# EAGLE design Board Tanggal v2 (EAGLE 6.6.0)
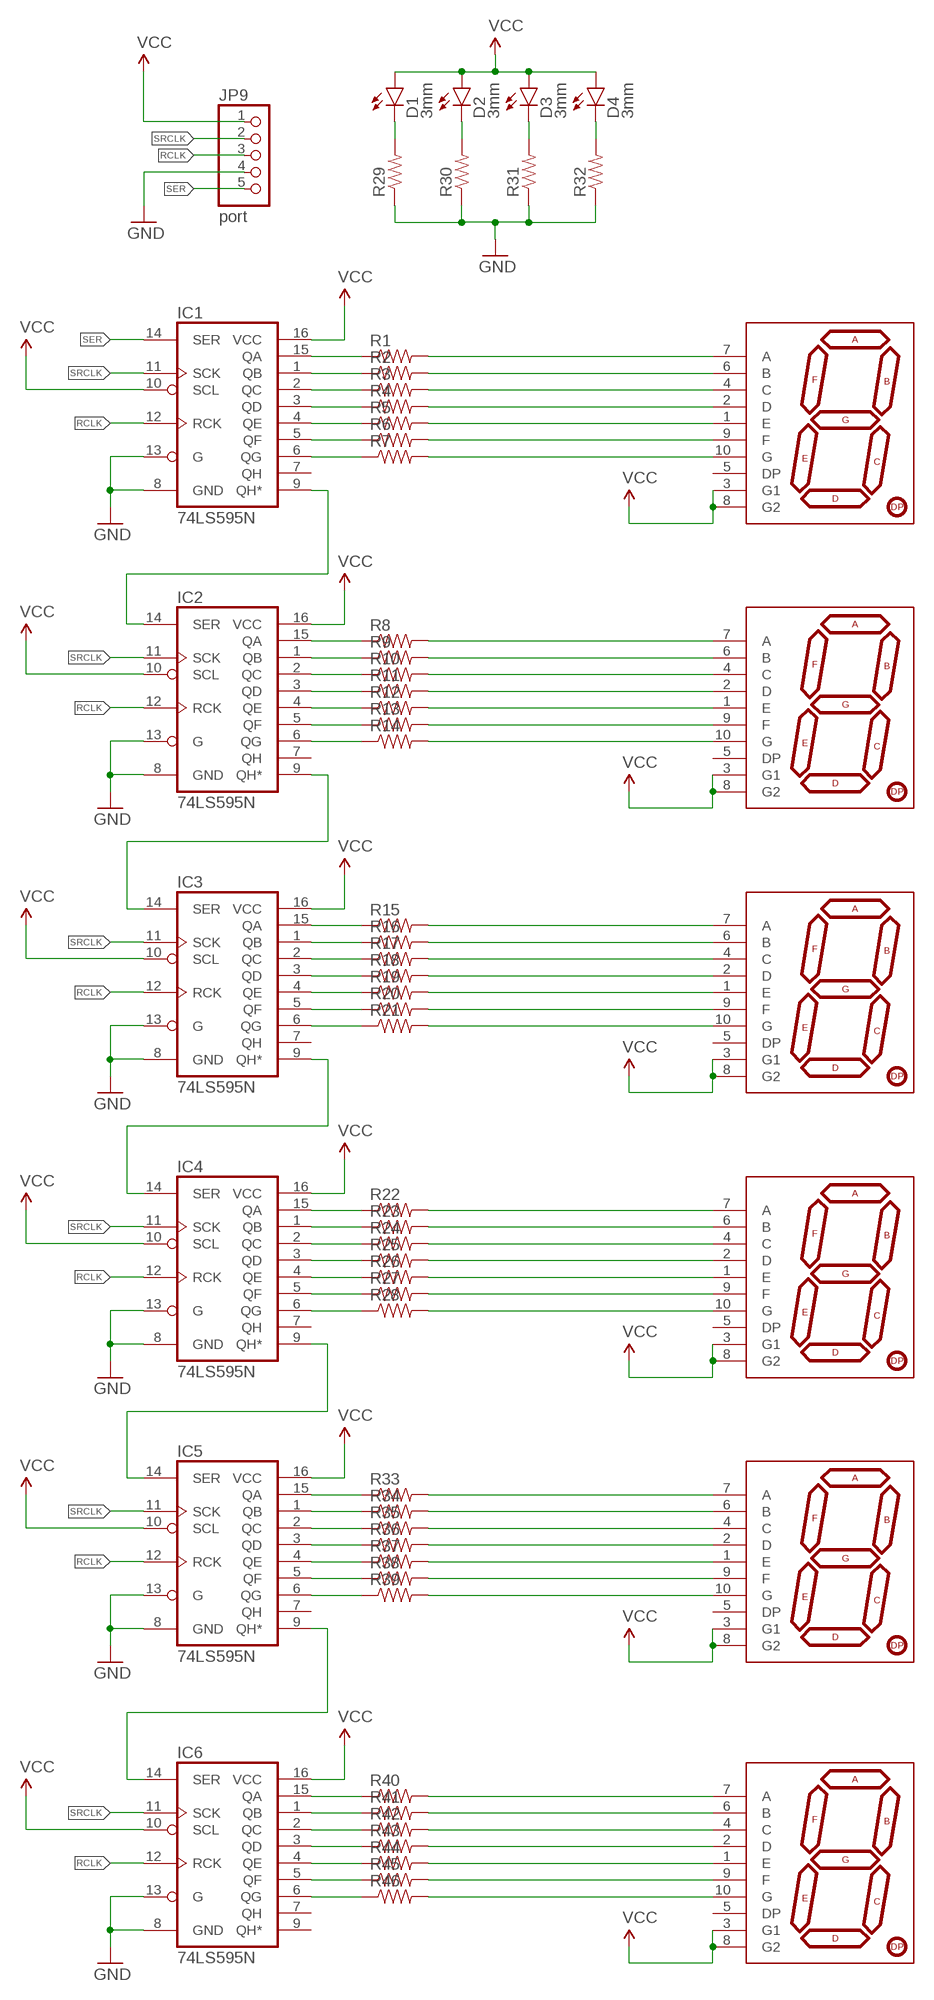
[diagram p0: schematic, sheet 1]

## Parts
D1  3mm  LED3MM  [LED3MM]
D2  3mm  LED3MM  [LED3MM]
D3  3mm  LED3MM  [LED3MM]
D4  3mm  LED3MM  [LED3MM]
IC1  74LS595N  [DIL16]
IC2  74LS595N  [DIL16]
IC3  74LS595N  [DIL16]
IC4  74LS595N  [DIL16]
IC5  74LS595N  [DIL16]
IC6  74LS595N  [DIL16]
JP9  port  PINHD-1X5  [1X05]
R1  RESISTORPTH-1/4W  [AXIAL-0.4]
R2  RESISTORPTH-1/4W  [AXIAL-0.4]
R3  RESISTORPTH-1/4W  [AXIAL-0.4]
R4  RESISTORPTH-1/4W  [AXIAL-0.4]
R5  RESISTORPTH-1/4W  [AXIAL-0.4]
R6  RESISTORPTH-1/4W  [AXIAL-0.4]
R7  RESISTORPTH-1/4W  [AXIAL-0.4]
R8  RESISTORPTH-1/4W  [AXIAL-0.4]
R9  RESISTORPTH-1/4W  [AXIAL-0.4]
R10  RESISTORPTH-1/4W  [AXIAL-0.4]
R11  RESISTORPTH-1/4W  [AXIAL-0.4]
R12  RESISTORPTH-1/4W  [AXIAL-0.4]
R13  RESISTORPTH-1/4W  [AXIAL-0.4]
R14  RESISTORPTH-1/4W  [AXIAL-0.4]
R15  RESISTORPTH-1/4W  [AXIAL-0.4]
R16  RESISTORPTH-1/4W  [AXIAL-0.4]
R17  RESISTORPTH-1/4W  [AXIAL-0.4]
R18  RESISTORPTH-1/4W  [AXIAL-0.4]
R19  RESISTORPTH-1/4W  [AXIAL-0.4]
R20  RESISTORPTH-1/4W  [AXIAL-0.4]
R21  RESISTORPTH-1/4W  [AXIAL-0.4]
R22  RESISTORPTH-1/4W  [AXIAL-0.4]
R23  RESISTORPTH-1/4W  [AXIAL-0.4]
R24  RESISTORPTH-1/4W  [AXIAL-0.4]
R25  RESISTORPTH-1/4W  [AXIAL-0.4]
R26  RESISTORPTH-1/4W  [AXIAL-0.4]
R27  RESISTORPTH-1/4W  [AXIAL-0.4]
R28  RESISTORPTH-1/4W  [AXIAL-0.4]
R29  RESISTORPTH-1/4W  [AXIAL-0.4]
R30  RESISTORPTH-1/4W  [AXIAL-0.4]
R31  RESISTORPTH-1/4W  [AXIAL-0.4]
R32  RESISTORPTH-1/4W  [AXIAL-0.4]
R33  RESISTORPTH-1/4W  [AXIAL-0.4]
R34  RESISTORPTH-1/4W  [AXIAL-0.4]
R35  RESISTORPTH-1/4W  [AXIAL-0.4]
R36  RESISTORPTH-1/4W  [AXIAL-0.4]
R37  RESISTORPTH-1/4W  [AXIAL-0.4]
R38  RESISTORPTH-1/4W  [AXIAL-0.4]
R39  RESISTORPTH-1/4W  [AXIAL-0.4]
R40  RESISTORPTH-1/4W  [AXIAL-0.4]
R41  RESISTORPTH-1/4W  [AXIAL-0.4]
R42  RESISTORPTH-1/4W  [AXIAL-0.4]
R43  RESISTORPTH-1/4W  [AXIAL-0.4]
R44  RESISTORPTH-1/4W  [AXIAL-0.4]
R45  RESISTORPTH-1/4W  [AXIAL-0.4]
R46  RESISTORPTH-1/4W  [AXIAL-0.4]
U$1  7-SEGMENT-DISPLAY-1"-REDEZ  [7-SEGMENT-1"PTH-EZ]
U$2  7-SEGMENT-DISPLAY-1"-REDEZ  [7-SEGMENT-1"PTH-EZ]
U$3  7-SEGMENT-DISPLAY-1"-REDEZ  [7-SEGMENT-1"PTH-EZ]
U$4  7-SEGMENT-DISPLAY-1"-REDEZ  [7-SEGMENT-1"PTH-EZ]
U$5  7-SEGMENT-DISPLAY-1"-REDEZ  [7-SEGMENT-1"PTH-EZ]
U$6  7-SEGMENT-DISPLAY-1"-REDEZ  [7-SEGMENT-1"PTH-EZ]

## Nets
A_0: R1.P$2 U$1.7(A)
A_2: R15.P$2 U$3.7(A)
A_3: R22.P$2 U$4.7(A)
A_4: R33.P$2 U$5.7(A)
A_5: R40.P$2 U$6.7(A)
B_0: R2.P$2 U$1.6(B)
B_1: R9.P$2 U$2.6(B)
B_2: R16.P$2 U$3.6(B)
B_3: R23.P$2 U$4.6(B)
B_4: R34.P$2 U$5.6(B)
B_5: R41.P$2 U$6.6(B)
C_0: R3.P$2 U$1.4(C)
C_1: R10.P$2 U$2.4(C)
C_2: R17.P$2 U$3.4(C)
C_3: R24.P$2 U$4.4(C)
C_4: R35.P$2 U$5.4(C)
C_5: R42.P$2 U$6.4(C)
D_0: R4.P$2 U$1.2(D)
D_1: R11.P$2 U$2.2(D)
D_2: R18.P$2 U$3.2(D)
D_3: R25.P$2 U$4.2(D)
D_4: R36.P$2 U$5.2(D)
D_5: R43.P$2 U$6.2(D)
E_0: R5.P$2 U$1.1(E)
E_1: R12.P$2 U$2.1(E)
E_2: R19.P$2 U$3.1(E)
E_3: R26.P$2 U$4.1(E)
E_4: R37.P$2 U$5.1(E)
E_5: R44.P$2 U$6.1(E)
F_0: R6.P$2 U$1.9(F)
F_1: R13.P$2 U$2.9(F)
F_2: R20.P$2 U$3.9(F)
F_3: R27.P$2 U$4.9(F)
F_4: R38.P$2 U$5.9(F)
F_5: R45.P$2 U$6.9(F)
G_0: R7.P$2 U$1.10(G)
G_1: R14.P$2 U$2.10(G)
G_2: R21.P$2 U$3.10(G)
G_3: R28.P$2 U$4.10(G)
G_4: R39.P$2 U$5.10(G)
G_5: R46.P$2 U$6.10(G)
GND: IC1.8(GND) IC1.13(G) IC2.8(GND) IC2.13(G) IC3.8(GND) IC3.13(G) IC4.8(GND) IC4.13(G) IC5.8(GND) IC5.13(G) IC6.8(GND) IC6.13(G) JP9.4 R29.P$1 R30.P$1 R31.P$1 R32.P$1
N$1: IC1.15(QA) R1.P$1
N$2: IC2.15(QA) R8.P$1
N$3: IC1.1(QB) R2.P$1
N$4: IC1.2(QC) R3.P$1
N$5: IC1.3(QD) R4.P$1
N$6: IC1.4(QE) R5.P$1
N$7: IC1.5(QF) R6.P$1
N$8: IC1.6(QG) R7.P$1
N$9: IC2.1(QB) R9.P$1
N$10: IC2.2(QC) R10.P$1
N$11: IC2.3(QD) R11.P$1
N$12: IC2.4(QE) R12.P$1
N$13: IC2.5(QF) R13.P$1
N$14: IC2.6(QG) R14.P$1
N$15: IC3.15(QA) R15.P$1
N$16: IC3.1(QB) R16.P$1
N$17: IC3.2(QC) R17.P$1
N$18: IC3.3(QD) R18.P$1
N$19: IC3.4(QE) R19.P$1
N$20: IC3.5(QF) R20.P$1
N$21: IC3.6(QG) R21.P$1
N$22: IC4.15(QA) R22.P$1
N$23: IC4.1(QB) R23.P$1
N$24: IC4.2(QC) R24.P$1
N$25: IC4.3(QD) R25.P$1
N$26: IC4.4(QE) R26.P$1
N$27: IC4.5(QF) R27.P$1
N$28: IC4.6(QG) R28.P$1
N$29: IC1.9(QH*) IC2.14(SER)
N$30: IC2.9(QH*) IC3.14(SER)
N$31: IC3.9(QH*) IC4.14(SER)
N$32: D1.K(C) R29.P$2
N$33: D2.K(C) R30.P$2
N$34: D3.K(C) R31.P$2
N$35: D4.K(C) R32.P$2
N$36: IC5.15(QA) R33.P$1
N$37: IC5.1(QB) R34.P$1
N$38: IC5.2(QC) R35.P$1
N$39: IC5.3(QD) R36.P$1
N$40: IC5.4(QE) R37.P$1
N$41: IC5.5(QF) R38.P$1
N$42: IC5.6(QG) R39.P$1
N$43: IC4.9(QH*) IC5.14(SER)
N$44: IC6.15(QA) R40.P$1
N$45: IC6.1(QB) R41.P$1
N$46: IC6.2(QC) R42.P$1
N$47: IC6.3(QD) R43.P$1
N$48: IC6.4(QE) R44.P$1
N$49: IC6.5(QF) R45.P$1
N$50: IC6.6(QG) R46.P$1
N$51: IC5.9(QH*) IC6.14(SER)
N$52: R8.P$2 U$2.7(A)
RCLK: IC1.12(RCK) IC2.12(RCK) IC3.12(RCK) IC4.12(RCK) IC5.12(RCK) IC6.12(RCK) JP9.3
SER: IC1.14(SER) JP9.5
SRCLK: IC1.11(SCK) IC2.11(SCK) IC3.11(SCK) IC4.11(SCK) IC5.11(SCK) IC6.11(SCK) JP9.2
VCC: D1.A D2.A D3.A D4.A IC1.10(SCL) IC1.16(VCC) IC2.10(SCL) IC2.16(VCC) IC3.10(SCL) IC3.16(VCC) IC4.10(SCL) IC4.16(VCC) IC5.10(SCL) IC5.16(VCC) IC6.10(SCL) IC6.16(VCC) JP9.1 U$1.3(G1) U$1.8(G2) U$2.3(G1) U$2.8(G2) U$3.3(G1) U$3.8(G2) U$4.3(G1) U$4.8(G2) U$5.3(G1) U$5.8(G2) U$6.3(G1) U$6.8(G2)
Unconnected: IC1.7(QH) IC2.7(QH) IC3.7(QH) IC4.7(QH) IC5.7(QH) IC6.7(QH) IC6.9(QH*) U$1.5(DP) U$2.5(DP) U$3.5(DP) U$4.5(DP) U$5.5(DP) U$6.5(DP)

## Library data of the parts
D1-D4 = SparkFun-LED:LED: LEDs Standard schematic elements and footprints for 5mm, 3mm, 1206, and 0603 sized LEDs. 5mm - Spark Fun Electronics SKU : COM-00529 (and others)
IC1-IC6 = SparkFun-DigitalIC:74*595: 8-bit SHIFT REGISTER, output latch
JP9 = pinhead:PINHD-1X5: PIN HEADER
R1-R46 = SparkFun-Passives:RESISTOR: Resistor Basic schematic elements and footprints for 0603, 1206, and PTH resistors.
U$1-U$6 = yogaLibrary:7-SEGMENT-DISPLAY-1"-RED: 7-Segment Display 1" Red (COM-08546) EZ is for kits. Pads are only exposed on the bottom side to help prevent soldering in upside down.

## Board
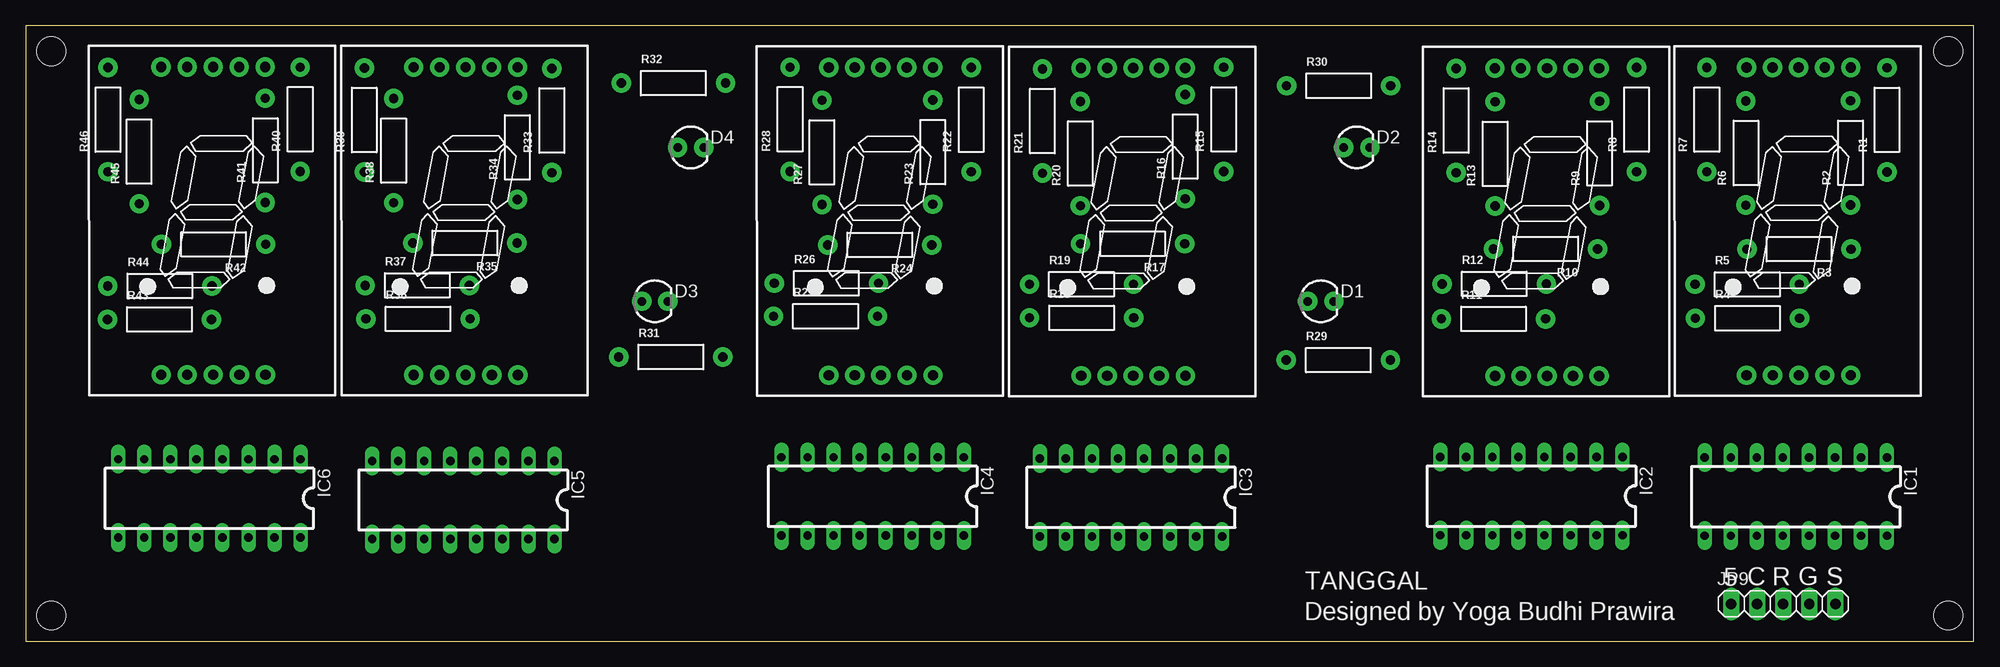
[diagram p1: board, top side]
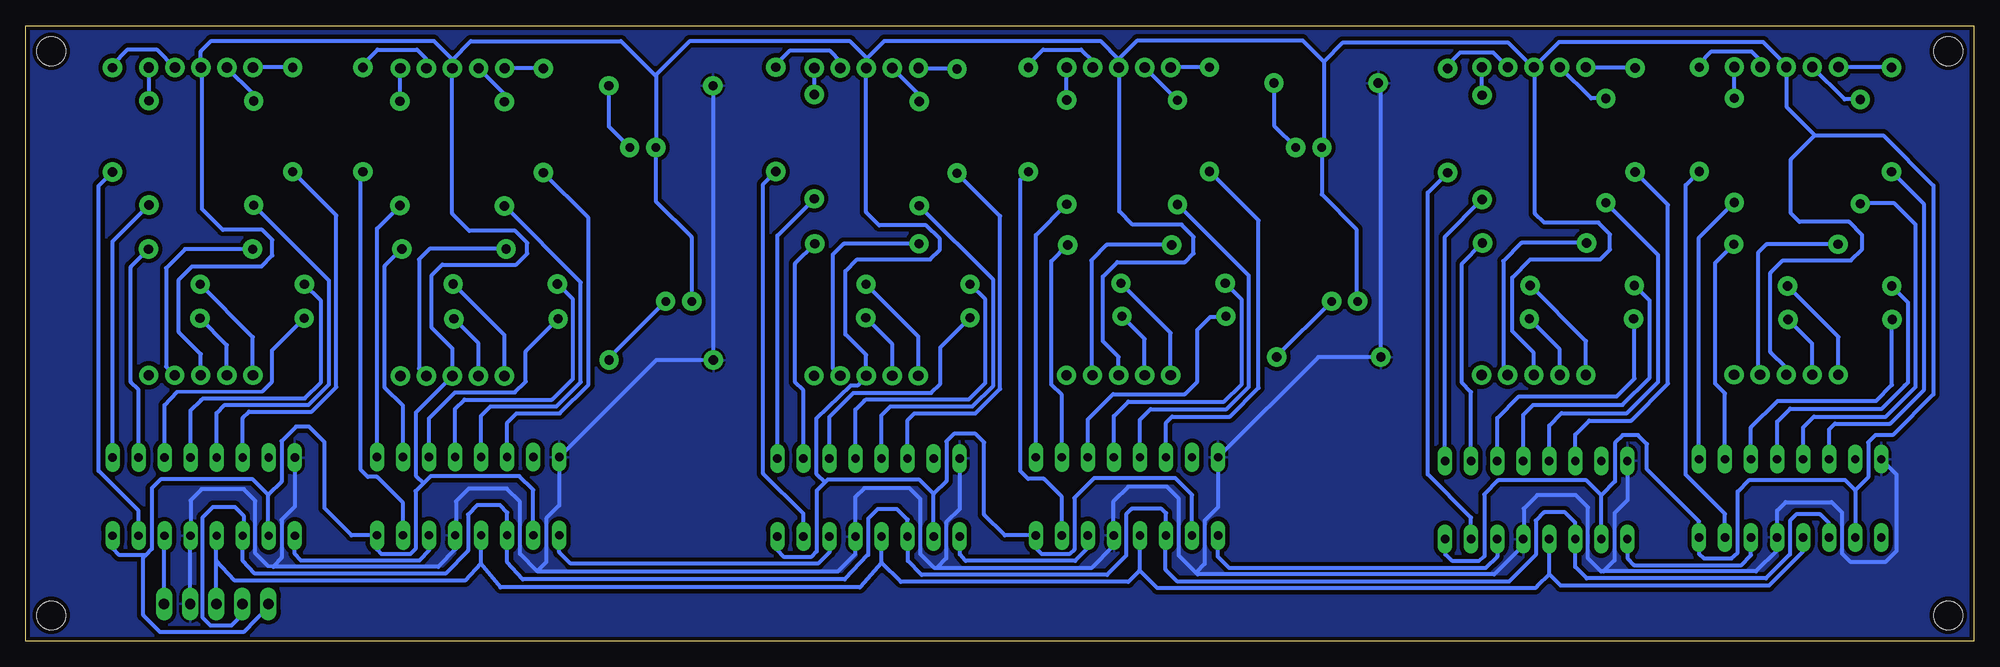
[diagram p2: board, bottom side, seen from below]

Size 190 x 60 mm. Coordinates in mm from the lower left corner, seen from the top.
Outline: 0,0 190,0 190,60 0,60 0,0
Copper layers (1*16): Top 0.035mm / dielectric 1.5mm / Bottom 0.035mm
Design rules "SparkFun": minimum track width 8mil, minimum drill 20mil, track to track 8mil, track to pad 8mil, pad to pad 8mil, via to via 8mil, smd to smd 8mil, copper to edge 8mil, drill to drill 8mil, minimum pad ring 12mil, minimum via ring 10mil, stop-mask expansion 4mil, vias tented up to drill 20mil, thermal gap 10mil
Holes 2.8 mm at 2.5,57.5 2.5,2.5 187.5,57.5 187.5,2.5

### Footprints (pad centres in the part's own frame; a part is rotated, then mirrored left to right if it is on the bottom)
LED3MM = drill 0.813 pad 1.88: A -1.27,0; K 1.27,0
DIL16 = drill 0.813 long: 1 -8.89,-3.81; 2 -6.35,-3.81; 3 -3.81,-3.81; 4 -1.27,-3.81; 5 1.27,-3.81; 6 3.81,-3.81; 7 6.35,-3.81; 8 8.89,-3.81; 9 8.89,3.81; 10 6.35,3.81; 11 3.81,3.81; 12 1.27,3.81; 13 -1.27,3.81; 14 -3.81,3.81; 15 -6.35,3.81; 16 -8.89,3.81
1X05 = drill 1.016 long: 1 -5.08,0; 2 -2.54,0; 3 0,0; 4 2.54,0; 5 5.08,0
AXIAL-0.4 = drill 0.9 pad 1.88: P$1 -5.08,0; P$2 5.08,0
7-SEGMENT-1"PTH-EZ = drill 1 pad 1.88: 1 -4.95,-15.09; 2 -2.41,-15.09; 3 0.13,-15.09; 4 2.67,-15.09; 5 5.21,-15.09; 6 5.2,14.91; 7 2.66,14.91; 8 0.12,14.91; 9 -2.42,14.91; 10 -4.96,14.91

### Placement (x,y rotation side)
D1  126.31,33.12 0 top
D2  129.82,48.13 0 top
D3  61.36,33.12 0 top
D4  64.86,48.12 0 top
IC1  172.64,14.08 180 top
IC2  146.85,14.12 180 top
IC3  107.8,14 180 top
IC4  82.6,14.11 180 top
IC5  42.68,13.75 180 top
IC6  17.92,13.92 180 top
JP9  171.41,3.62 0 top
R1  181.52,50.81 90 top
R2  177.97,47.6 90 top
R3  172.95,38.21 180 top
R4  167.92,31.47 0 top
R5  167.9,34.78 0 top
R6  167.77,47.58 90 top
R7  163.96,50.84 90 top
R8  157.1,50.84 90 top
R9  153.49,47.54 90 top
R10  148.23,38.23 180 top
R11  143.15,31.41 0 top
R12  143.22,34.82 0 top
R13  143.31,47.5 90 top
R14  139.51,50.75 90 top
R15  116.85,50.86 90 top
R16  113.08,48.21 90 top
R17  107.95,38.73 180 top
R18  102.98,31.51 0 top
R19  102.97,34.79 0 top
R20  102.86,47.53 90 top
R21  99.16,50.7 90 top
R22  92.21,50.83 90 top
R23  88.47,47.67 90 top
R24  83.3,38.62 180 top
R25  78.01,31.67 0 top
R26  78.09,34.88 0 top
R27  77.66,47.65 90 top
R28  74.55,50.87 90 top
R29  128.01,27.39 0 top
R30  128.05,54.14 0 top
R31  62.92,27.69 0 top
R32  63.17,54.4 0 top
R33  51.32,50.75 90 top
R34  47.96,48.13 90 top
R35  42.84,38.81 180 top
R36  38.27,31.41 0 top
R37  38.19,34.67 0 top
R38  35.89,47.82 90 top
R39  33.03,50.8 90 top
R40  26.77,50.87 90 top
R41  23.37,47.84 90 top
R42  18.33,38.68 180 top
R43  13.05,31.36 0 top
R44  13.09,34.61 0 top
R45  11.07,47.72 90 top
R46  8.03,50.84 90 top
U$1  172.79,41 0 top
U$2  148.25,40.94 0 top
U$3  107.89,40.96 0 top
U$4  83.28,41 0 top
U$5  42.79,41.04 0 top
U$6  18.17,41.05 0 top

### Tracks (layer width: path | path; a pad name or v marks a point on that pad's centre or on a via)
A_0
  Bottom 0.406: R1.P$2 181.52,56.19 180.03,57.68 177.22,57.68 U$1.7
A_2
  Bottom 0.406: R15.P$2 116.85,56.19 115.45,57.59 111.61,57.59 110.51,56.49 110.51,55.91 U$3.7
A_3
  Bottom 0.406: R22.P$2 92.21,56.22 90.76,57.67 87.06,57.67 85.95,56.56 U$4.7
A_4
  Bottom 0.406: R33.P$2 51.32,56.17 50.1,57.39 46.89,57.39 U$5.7
A_5
  Bottom 0.406: R40.P$2 26.77,56.3 25.59,57.48 21.7,57.48 20.84,56.62 U$6.7
B_0
  Bottom 0.406: R2.P$2 177.97,55.89 U$1.6
B_1
  Bottom 0.406: R9.P$2 153.49,55.81 U$2.6
B_2
  Bottom 0.406: R16.P$2 U$3.6
B_3
  Bottom 0.406: R23.P$2 U$4.6
B_4
  Bottom 0.406: R34.P$2 47.96,55.92 U$5.6
B_5
  Bottom 0.406: R41.P$2 U$6.6
C_0
  Bottom 0.406: R3.P$2 174.44,38.21 176.3,36.35 176.3,26.75 U$1.4
C_1
  Bottom 0.406: R10.P$2 150.6,38.23 151.63,37.2 151.63,26.56 U$2.4
C_2
  Bottom 0.406: R17.P$2 110.23,38.73 111.29,37.67 111.29,26.6 U$3.4
C_3
  Bottom 0.406: R24.P$2 84.57,38.62 86.07,37.12 86.07,26.03 U$4.4
C_4
  Bottom 0.406: R35.P$2 44.12,38.81 45.9,37.03 45.9,26.39 U$5.4
C_5
  Bottom 0.406: R42.P$2 20.22,38.68 21.06,37.84 21.06,26.18 U$6.4
D_0
  Bottom 0.406: U$1.2 170.38,28.85 R4.P$2
D_1
  Bottom 0.406: U$2.2 145.84,29.02 R11.P$2
D_2
  Bottom 0.406: U$3.2 105.48,28.93 R18.P$2
D_3
  Bottom 0.406: U$4.2 80.87,29.45 R25.P$2
D_4
  Bottom 0.406: U$5.2 40.38,28.44 R36.P$2
D_5
  Bottom 0.406: U$6.2 15.76,28.99 R43.P$2
E_0
  Bottom 0.406: U$1.1 167.84,29.64 R5.P$2
E_1
  Bottom 0.406: U$2.1 143.3,29.82 R12.P$2
E_2
  Bottom 0.406: U$3.1 102.94,29.68 R19.P$2
E_3
  Bottom 0.406: U$4.1 78.33,30.04 R26.P$2
E_4
  Bottom 0.406: U$5.1 37.84,29.24 R37.P$2
E_5
  Bottom 0.406: U$6.1 13.22,29.66 R44.P$2
F_0
  Bottom 0.406: R6.P$2 167.77,53.31 U$1.9
F_1
  Bottom 0.406: R13.P$2 143.31,53.33 U$2.9
F_2
  Bottom 0.406: R20.P$2 102.86,53.26 U$3.9
F_3
  Bottom 0.406: R27.P$2 77.68,52.73 U$4.9
F_4
  Bottom 0.406: R38.P$2 37.32,52.9 U$5.9
F_5
  Bottom 0.406: R45.P$2 12.59,52.8 U$6.9
G_0
  Bottom 0.406: R7.P$2 U$1.10
G_1
  Bottom 0.406: R14.P$2 143.27,55.83 U$2.10
G_2
  Bottom 0.406: R21.P$2 102.84,55.78 U$3.10
G_3
  Bottom 0.406: R28.P$2 78.28,55.95 U$4.10
G_4
  Bottom 0.406: R39.P$2 37.76,55.88 U$5.10
G_5
  Bottom 0.406: R46.P$2 13.17,55.92 U$6.10
GND
  Bottom 0.406: R32.P$1 57.84,54.15 R31.P$1 63.94,27.69 IC4.8 73.71,13.05 75.03,11.73 75.03,7.53 75.89,6.67 | R30.P$1 122.93,54.1 R29.P$1 128.5,27.39 IC2.8 137.96,13.23 139.24,11.95 139.24,7.69 140.1,6.83 | 36.12,6.8 21.25,6.8 19.19,8.86 IC6.13 19.19,12.71 18.35,13.55 13.87,13.55 12.87,12.55 12.87,8.54 12.06,7.73 8.58,7.73 7.52,8.79 7.52,16.22 IC6.8 | 36.12,6.8 36.37,6.8 37.64,8.07 37.64,13.04 38.83,14.23 42.57,14.23 43.9,12.9 43.9,9.99 | IC5.8 33.79,13.75 35.06,12.48 35.06,7.86 36.12,6.8 | 43.9,9.99 43.9,9.33 43.93,9.33 46.77,6.49 75.7,6.49 75.89,6.67 | 75.89,6.67 77.53,8.32 77.53,13.87 78.71,15.05 82.46,15.05 83.94,13.57 83.94,10.37 | 43.9,9.99 IC5.13 | 83.93,10.36 IC4.13 83.94,10.37 | 83.94,10.37 83.94,9.24 86.07,7.11 101.18,7.11 | 101.18,7.11 101.36,7.11 102.73,8.48 102.73,13.83 103.82,14.92 108.2,14.92 109.1,14.02 109.1,10.22 | 109.1,10.22 109.1,8.47 110.8,6.77 140.05,6.77 140.1,6.83 | 140.1,6.83 141.78,8.5 141.78,13.56 143.08,14.86 146.78,14.86 148.02,13.62 148.02,10.41 | 109.1,10.22 IC3.13 | IC3.8 98.91,12.87 100.22,11.56 100.22,8.07 101.18,7.11 | 148.02,10.41 148.02,8.96 148.11,8.96 149.77,7.22 165.85,7.22 | 165.85,7.22 166.35,7.3 167.59,8.54 167.59,13.66 168.73,14.8 172.83,14.8 173.92,13.71 IC1.13 173.95,10.23 JP9.4 | 148.02,10.41 IC2.13 | IC1.8 163.75,13.1 165.03,11.82 165.03,8.12 165.85,7.22
  pour Bottom (isolate 0.406): 0,60 190,60 190,0 0,0
N$1
  Bottom 0.406: IC1.15 178.99,12.69 182.88,16.58 182.88,44.37 R1.P$1
N$2
  Bottom 0.406: IC2.15 153.2,13.47 155.73,16 156.64,16 157.32,16.68 157.32,45.54 R8.P$1
N$3
  Bottom 0.406: IC1.1 181.53,38.96 R2.P$1
N$4
  Bottom 0.406: IC1.2 178.99,24.48 179.75,25.24 179.75,36.49 R3.P$1
N$5
  Bottom 0.406: IC1.3 176.45,22.99 175.22,24.29 166.88,24.37 165.98,25.3 165.98,28.33 R4.P$1
N$6
  Bottom 0.406: IC1.4 173.91,22.49 172.9,23.5 172.86,23.5 172.69,23.67 162.77,23.67 161.2,25.24 161.2,33.16 R5.P$1
N$7
  Bottom 0.406: IC1.5 171.37,22.23 170.58,23.02 162.4,23.02 160.4,25.02 160.4,35.13 R6.P$1
N$8
  Bottom 0.406: IC1.6 168.83,21.75 168.21,22.37 162.08,22.37 159.7,24.75 159.7,41.5 R7.P$1
N$9
  Bottom 0.406: IC2.1 155.74,40.21 R9.P$1
N$10
  Bottom 0.406: IC2.2 153.2,22.94 154.97,24.71 154.97,36.57 R10.P$1
N$11
  Bottom 0.406: IC2.3 150.66,21.7 148.12,24.24 142.29,24.24 141.23,25.3 141.23,28.25 R11.P$1
N$12
  Bottom 0.406: IC2.4 148.12,22.63 147.21,23.54 138.66,23.54 136.63,25.57 136.63,33.31 R12.P$1
N$13
  Bottom 0.406: IC2.5 145.58,21.96 144.66,22.88 138.22,22.88 135.86,25.24 135.86,34.97 R13.P$1
N$14
  Bottom 0.406: IC2.6 143.04,21.29 142.13,22.2 137.91,22.2 135.1,25.01 135.1,41.26 R14.P$1
N$15
  Bottom 0.406: IC3.15 114.15,12.41 118.07,16.33 118.07,44.56 R15.P$1
N$16
  Bottom 0.406: IC3.1 116.69,39.52 R16.P$1
N$17
  Bottom 0.406: IC3.2 114.15,24.43 114.94,25.22 114.94,36.82 R17.P$1
N$18
  Bottom 0.406: IC3.3 111.61,21.85 109.26,24.2 101.69,24.2 100.79,25.1 100.79,28.62 R18.P$1
N$19
  Bottom 0.406: IC3.4 109.07,22.57 108.2,23.44 108.17,23.44 108.04,23.57 98,23.57 96.41,25.16 96.41,33.31 R19.P$1
N$20
  Bottom 0.406: IC3.5 106.53,22 105.66,22.87 97.67,22.87 95.63,24.91 95.63,35.22 R20.P$1
N$21
  Bottom 0.406: IC3.6 103.99,21.53 103.33,22.19 97.37,22.19 94.97,24.59 94.97,41.43 R21.P$1
N$22
  Bottom 0.406: IC4.15 88.95,14.06 90.71,15.82 92.24,15.82 92.98,16.56 92.98,44.98 R22.P$1
N$23
  Bottom 0.406: IC4.1 91.49,39.57 R23.P$1
N$24
  Bottom 0.406: IC4.2 88.95,23.99 89.97,25.01 89.97,37.03 R24.P$1
N$25
  Bottom 0.406: IC4.3 86.41,21.61 83.94,24.08 76.96,24.08 75.74,25.3 75.74,30.33 74.47,31.6 73,31.6 R25.P$1
N$26
  Bottom 0.406: IC4.4 83.87,21.92 82.45,23.34 73.12,23.34 71.4,25.06 71.4,33.27 R26.P$1
N$27
  Bottom 0.406: IC4.5 81.33,21.56 80.29,22.6 72.89,22.6 70.72,24.77 70.72,35.63 R27.P$1
N$28
  Bottom 0.406: IC4.6 78.79,21.3 78.2,21.89 72.56,21.89 69.77,24.68 69.77,41.01 R28.P$1
N$29
  Bottom 0.406: IC2.14 150.66,8.86 151.6,7.85 163.14,7.85 163.74,8.49 IC1.9
N$30
  Bottom 0.406: IC3.14 111.61,8.67 112.74,7.54 136.83,7.54 137.96,8.67 IC2.9
N$31
  Bottom 0.406: IC4.14 86.41,9.11 87.65,7.81 98.33,7.81 98.9,8.44 IC3.9
N$32
  Bottom 0.406: R29.P$2 133.09,27.61 D1.K
N$33
  Bottom 0.406: R30.P$2 133.13,50.17 D2.K
N$34
  Bottom 0.406: R31.P$2 68,27.75 D3.K
N$35
  Bottom 0.406: R32.P$2 68.25,50.24 D4.K
N$36
  Bottom 0.406: IC5.15 49.03,12.03 53.26,16.26 53.26,43.73 R33.P$1
N$37
  Bottom 0.406: IC5.1 51.57,39.44 R34.P$1
N$38
  Bottom 0.406: IC5.2 49.03,24.28 49.93,25.18 49.93,36.8 R35.P$1
N$39
  Bottom 0.406: IC5.3 46.49,21.73 44.36,23.86 34.82,23.86 33.1,25.58 33.1,31.32 R36.P$1
N$40
  Bottom 0.406: IC5.4 43.95,22.04 42.96,23.03 34.27,23.03 31.62,25.68 31.62,33.18 R37.P$1
N$41
  Bottom 0.406: IC5.5 41.41,21.01 40.21,22.21 33.84,22.21 30.78,25.27 30.78,37.63 R38.P$1
N$42
  Bottom 0.406: IC5.6 38.87,20.13 37.5,21.5 33.42,21.5 29.83,25.09 29.83,42.52 R39.P$1
N$43
  Bottom 0.406: IC5.14 46.49,8.24 47.62,7.11 72.62,7.11 73.73,8.22 73.73,10.28 IC4.9
N$44
  Bottom 0.406: IC6.15 24.27,12.39 28.1,16.22 28.1,44.46 R40.P$1
N$45
  Bottom 0.406: IC6.1 26.81,39.32 R41.P$1
N$46
  Bottom 0.406: IC6.2 24.27,24.14 25.22,25.09 25.22,36.87 R42.P$1
N$47
  Bottom 0.406: IC6.3 21.73,20.82 19.13,23.42 9.54,23.42 7.99,24.97 7.99,31.34 R43.P$1
N$48
  Bottom 0.406: IC6.4 19.19,21.39 17.91,22.67 8.98,22.67 6.75,24.9 6.72,24.9 6.4,25.22 6.4,33 R44.P$1
N$49
  Bottom 0.406: IC6.5 16.65,20.83 15.6,21.88 8.59,21.88 5.68,24.79 5.68,40.61 7.75,42.68 11.03,42.68 R45.P$1
N$50
  Bottom 0.406: IC6.6 14.11,20.63 13.55,21.19 8.16,21.19 4.85,24.5 4.85,42.58 R46.P$1
N$51
  Bottom 0.406: IC5.9 33.79,8.08 33.16,7.41 22.67,7.41 21.74,8.38 IC6.14
N$52
  Bottom 0.406: R8.P$2 157.1,56.23 155.67,57.66 151.82,57.66 150.95,56.79 150.95,55.89 U$2.7
RCLK
  Bottom 0.406: IC6.12 16.65,8.74 19.99,5.4 40.28,5.4 41.4,6.52 | 41.4,6.52 IC5.12 | 41.4,6.52 42.6,5.32 42.61,5.32 42.77,5.16 79.63,5.16 81.33,6.86 | 81.33,6.86 IC4.12 | 81.33,6.86 81.38,6.86 82.47,5.77 104.65,5.77 106.52,7.64 | 106.52,7.64 IC3.12 | 106.52,7.64 108.64,5.23 143.69,5.23 145.58,7.53 | 145.58,7.53 IC2.12 | 145.58,7.53 145.63,7.53 147.15,5.9 169.59,5.9 171.41,7.83 | 171.47,3.56 JP9.3 171.41,7.83 | 171.41,7.83 171.41,10.23 IC1.12
SER
  Bottom 0.406: JP9.5 176.49,10.23 IC1.14
SRCLK
  Bottom 0.406: 168.87,10.23 IC1.11 | IC6.11 14.11,11.47 14.98,12.34 17.32,12.34 17.95,11.71 17.95,8.45 20.28,6.12 37.76,6.12 38.88,7.24 IC5.11 38.87,11.55 39.87,12.55 41.92,12.55 42.72,11.75 42.72,8.41 45.34,5.79 77.66,5.79 78.83,6.96 78.83,10.26 IC4.11 78.79,12.46 79.22,12.89 82.15,12.89 82.68,12.36 82.68,8.32 84.54,6.46 102.62,6.46 103.97,7.81 103.97,10.17 IC3.11 103.99,11.83 105.03,12.87 106.9,12.87 107.84,11.93 107.84,8.39 107.91,8.39 110.13,6.01 141.53,6.01 143.02,7.66 143.02,10.29 IC2.11 143.04,12.53 143.75,13.24 145.95,13.24 146.87,12.32 146.87,8.82 149.04,6.58 167.66,6.58 168.82,7.81 IC1.11 | 168.79,10.23 IC1.11 | JP9.2 168.87,2.55 169.93,1.51 171.96,1.51 172.72,2.25 172.72,12.08 171.72,13.08 169.61,13.08 168.75,12.22 168.75,10.35 IC1.11
VCC
  Bottom 0.406: U$6.3 18.3,26.65 19.83,28.18 19.83,35.89 18.61,37.11 11.98,37.11 10.89,38.2 10.89,39.58 12.17,40.86 17.01,40.86 17.85,41.7 17.85,46.96 15.5,49.31 | U$5.3 42.92,28.1 45.03,30.21 45.03,35.43 43.26,37.2 36.45,37.2 35.49,38.16 35.49,39.66 36.62,40.79 41.91,40.79 42.79,41.67 42.79,55.83 U$5.8 | D3.A 60.22,33.25 60.22,40.17 63.59,43.54 D4.A 63.41,48.3 63.41,56.49 | U$4.3 83.41,27.71 84.95,29.25 84.95,35.53 83.54,36.94 76.94,36.94 76.09,37.79 76.09,39.41 77.27,40.59 82.04,40.59 83.33,41.88 83.33,55.84 U$4.8 83.4,56.72 | D1.A 125.06,33.14 125.06,39.41 128.55,42.9 D2.A 128.53,48.15 128.53,55.08 | U$1.3 172.92,27.98 175.06,30.12 175.06,35.23 173.76,36.53 167,36.53 165.94,37.59 165.94,39.11 166.92,40.09 170.77,40.09 172.8,42.12 172.8,55.8 U$1.8 172.91,57.49 171.89,58.51 150.19,58.51 148.37,56.69 | IC1.10 166.33,10.23 166.33,14.24 | U$5.8 40.47,58.39 20.55,58.39 18.29,56.13 U$6.8 18.29,52.1 15.5,49.31 | U$5.8 43.02,55.95 45.38,58.31 61.59,58.31 63.41,56.49 | 83.4,56.72 81.56,58.56 65.48,58.56 63.41,56.49 | 107.95,56.83 108.01,56.77 U$3.8 108.04,55.84 108.04,41.82 106.75,40.53 102.18,40.53 100.85,39.2 100.85,38.15 101.8,37.2 108.91,37.2 110.04,36.07 110.04,29.91 108.02,27.89 U$3.3 108.02,25.75 108.88,24.89 109.53,24.89 112.91,21.69 112.91,16.33 112.06,15.47 | 107.95,56.83 106.26,58.52 85.2,58.52 83.4,56.72 | 148.37,56.69 U$2.8 148.39,55.83 148.39,41.66 146.73,40 142.25,40 141.08,38.83 141.08,37.76 142.15,36.69 149.38,36.69 150.4,35.67 150.4,30.53 148.38,28.51 U$2.3 151.95,22.28 151.95,16.13 151.2,15.38 | 107.95,56.83 109.59,58.46 125.26,58.46 128.53,55.19 128.53,55.08
  Bottom 0.406: 15.5,49.31 8.85,49.31 3.95,44.41 3.95,24.04 7.91,20.08 9.6,20.08 10.31,19.37 10.31,15.96 11.57,14.7 | IC6.10 11.62,10.16 11.62,10.85 11.57,10.9 11.57,14.7 | 148.37,56.69 146.58,58.48 131.93,58.48 128.53,55.08 | 11.57,14.7 12.58,15.71 21.88,15.71 23.03,14.56 23.03,8.63 23.64,8.06 26.33,8.06 26.81,8.5 IC6.16 26.81,11.67 31.87,16.73 31.87,19.19 32.75,20.07 34.24,20.07 35,19.31 35,15.56 36.33,14.23 | IC5.10 36.33,14.23 | 36.33,14.23 37.77,15.67 46.4,15.67 47.76,14.31 47.76,8.24 48.32,7.78 50.84,7.78 51.56,8.44 IC5.16 51.6,9.91 | IC4.10 76.25,14.25 77.88,15.88 85.79,15.88 87.72,13.95 87.72,8.92 88.21,8.47 90.89,8.47 91.49,9.05 IC4.16 94.5,10.3 96.52,12.32 96.52,19.36 97.36,20.2 99.48,20.2 100.21,19.47 100.21,15.59 101.45,14.35 | IC3.10 101.45,14.35 | 101.45,14.35 102.81,15.71 111.82,15.71 112.06,15.47 | 112.06,15.47 112.86,14.67 112.86,8.74 113.41,8.19 116.02,8.19 116.71,8.88 116.71,10.17 IC3.16 | IC2.10 140.5,14.73 141.85,16.08 150.5,16.08 151.2,15.38 | 151.2,15.38 151.97,14.61 151.97,8.98 152.49,8.47 155.28,8.48 155.74,8.93 IC2.16 158.21,10.31 160.85,12.95 160.85,19.39 162.37,20.91 163.62,20.91 165.04,19.49 165.04,15.53 166.33,14.24 | 166.33,14.24 167.85,15.76 176.85,15.76 177.69,14.92 177.69,8.98 178.29,8.38 | 178.29,8.38 180.86,8.38 181.52,9.04 IC1.16 | JP9.1 166.33,3.33 168.75,0.87 176.89,0.87 178.51,2.53 178.51,8.16 178.29,8.38

### Text on the board
tNames: TANGGAL | 5 | C | R | G | S | Designed by Yoga Budhi Prawira